# EAGLE design serializer_24x (EAGLE 6.6.0)
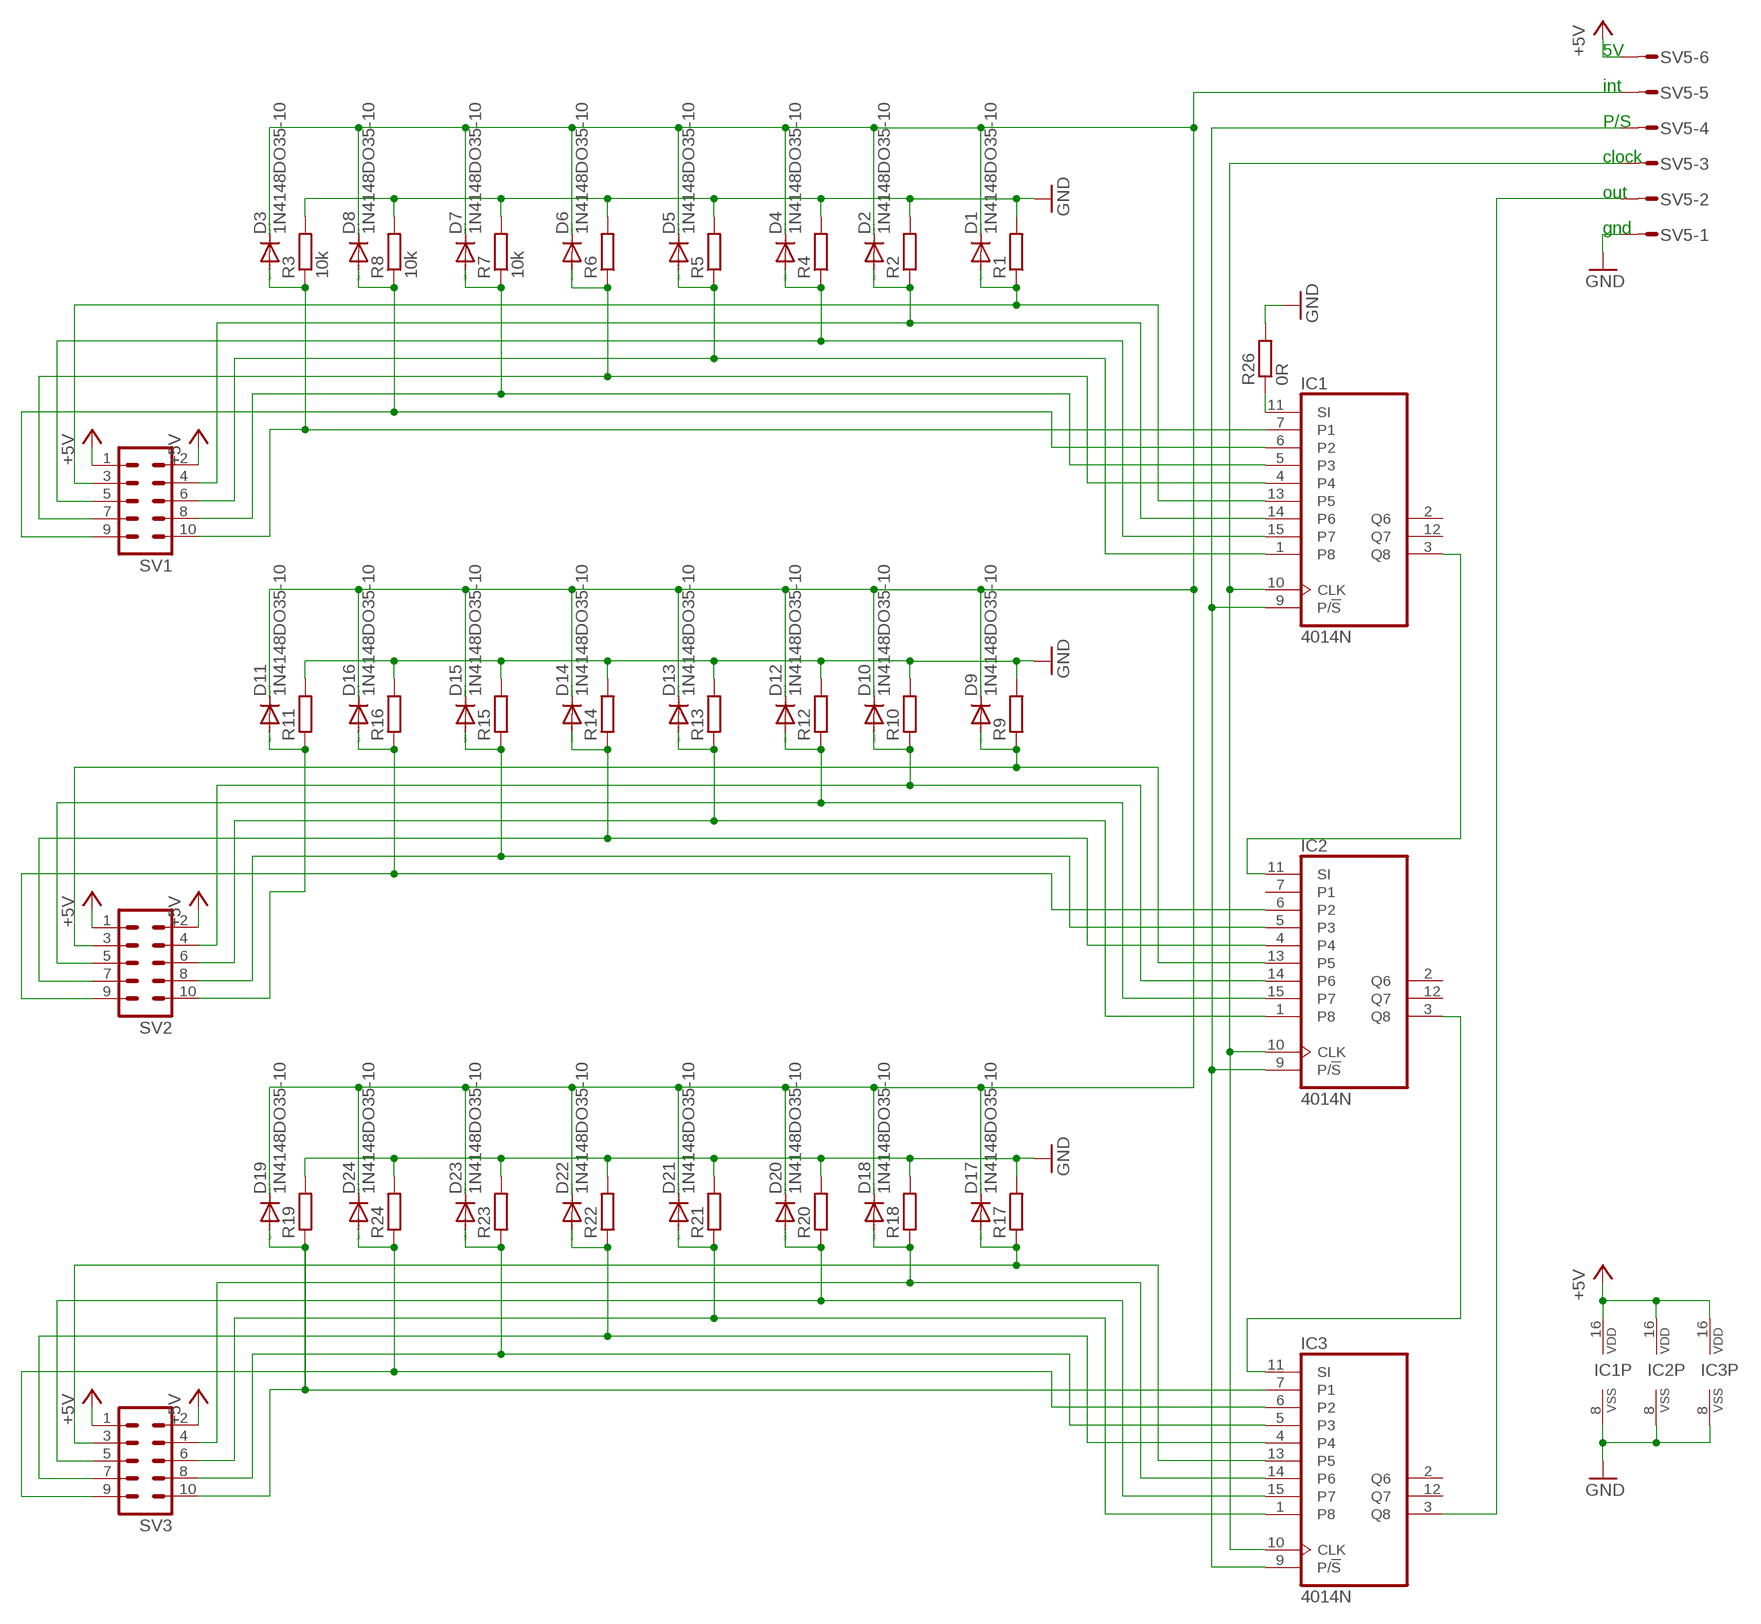
[diagram p0: schematic, sheet 1]

## Parts
D1  1N4148DO35-10  [DO35-10]
D2  1N4148DO35-10  [DO35-10]
D3  1N4148DO35-10  [DO35-10]
D4  1N4148DO35-10  [DO35-10]
D5  1N4148DO35-10  [DO35-10]
D6  1N4148DO35-10  [DO35-10]
D7  1N4148DO35-10  [DO35-10]
D8  1N4148DO35-10  [DO35-10]
D9  1N4148DO35-10  [DO35-10]
D10  1N4148DO35-10  [DO35-10]
D11  1N4148DO35-10  [DO35-10]
D12  1N4148DO35-10  [DO35-10]
D13  1N4148DO35-10  [DO35-10]
D14  1N4148DO35-10  [DO35-10]
D15  1N4148DO35-10  [DO35-10]
D16  1N4148DO35-10  [DO35-10]
D17  1N4148DO35-10  [DO35-10]
D18  1N4148DO35-10  [DO35-10]
D19  1N4148DO35-10  [DO35-10]
D20  1N4148DO35-10  [DO35-10]
D21  1N4148DO35-10  [DO35-10]
D22  1N4148DO35-10  [DO35-10]
D23  1N4148DO35-10  [DO35-10]
D24  1N4148DO35-10  [DO35-10]
IC1  4014N  [DIL16]
IC2  4014N  [DIL16]
IC3  4014N  [DIL16]
R1  R-EU_M1206  [M1206]
R2  R-EU_M1206  [M1206]
R3  10k  R-EU_M1206  [M1206]
R4  R-EU_M1206  [M1206]
R5  R-EU_M1206  [M1206]
R6  R-EU_M1206  [M1206]
R7  10k  R-EU_M1206  [M1206]
R8  10k  R-EU_M1206  [M1206]
R9  R-EU_M1206  [M1206]
R10  R-EU_M1206  [M1206]
R11  R-EU_M1206  [M1206]
R12  R-EU_M1206  [M1206]
R13  R-EU_M1206  [M1206]
R14  R-EU_M1206  [M1206]
R15  R-EU_M1206  [M1206]
R16  R-EU_M1206  [M1206]
R17  R-EU_M1206  [M1206]
R18  R-EU_M1206  [M1206]
R19  R-EU_M1206  [M1206]
R20  R-EU_M1206  [M1206]
R21  R-EU_M1206  [M1206]
R22  R-EU_M1206  [M1206]
R23  R-EU_M1206  [M1206]
R24  R-EU_M1206  [M1206]
R26  0R  R-EU_M1206  [M1206]
SV1  ML10  [ML10]
SV2  ML10  [ML10]
SV3  ML10  [ML10]
SV5  S06P  [S06P]

## Nets
+5V: IC1.16(VDD) IC2.16(VDD) IC3.16(VDD) SV1.1 SV1.2 SV2.1 SV2.2 SV3.1 SV3.2 SV5.6
GND: IC1.8(VSS) IC2.8(VSS) IC3.8(VSS) R1.2 R2.2 R3.2 R4.2 R5.2 R6.2 R7.2 R8.2 R9.2 R10.2 R11.2 R12.2 R13.2 R14.2 R15.2 R16.2 R17.2 R18.2 R19.2 R20.2 R21.2 R22.2 R23.2 R24.2 R26.2 SV5.1
N$1: D1.A IC1.13(P5) R1.1 SV1.3
N$2: D2.A IC1.14(P6) R2.1 SV1.4
N$3: D9.A IC2.13(P5) R9.1 SV2.3
N$4: D10.A IC2.14(P6) R10.1 SV2.4
N$7: D12.A IC2.15(P7) R12.1 SV2.5
N$8: D13.A IC2.1(P8) R13.1 SV2.6
N$9: D14.A IC2.4 R14.1 SV2.7
N$10: D15.A IC2.5(P3) R15.1 SV2.8
N$11: D16.A IC2.6(P2) R16.1 SV2.9
N$12: IC2.3(Q8) IC3.11(SI)
N$13: IC1.10(CLK) IC2.10(CLK) IC3.10(CLK) SV5.3
N$15: D17.A IC3.13(P5) R17.1 SV3.3
N$16: D18.A IC3.14(P6) R18.1 SV3.4
N$17: D1.C D2.C D3.C D4.C D5.C D6.C D7.C D8.C D9.C D10.C D11.C D12.C D13.C D14.C D15.C D16.C D17.C D18.C D19.C D20.C D21.C D22.C D23.C D24.C SV5.5
N$18: D19.A IC3.7(P1) R19.1 SV3.10
N$19: D20.A IC3.15(P7) R20.1 SV3.5
N$20: D21.A IC3.1(P8) R21.1 SV3.6
N$21: D22.A IC3.4 R22.1 SV3.7
N$22: D23.A IC3.5(P3) R23.1 SV3.8
N$23: D24.A IC3.6(P2) R24.1 SV3.9
N$24: IC1.11(SI) R26.1
N$29: D11.A R11.1 SV2.10
N$36: IC3.3(Q8) SV5.2
N$39: D3.A IC1.7(P1) R3.1 SV1.10
N$40: IC1.9(P/!S) IC2.9(P/!S) IC3.9(P/!S) SV5.4
N$41: D4.A IC1.15(P7) R4.1 SV1.5
N$43: D5.A IC1.1(P8) R5.1 SV1.6
N$45: D6.A IC1.4 R6.1 SV1.7
N$47: D7.A IC1.5(P3) R7.1 SV1.8
N$49: D8.A IC1.6(P2) R8.1 SV1.9
N$51: IC1.3(Q8) IC2.11(SI)
Unconnected: IC1.2(Q6) IC1.12(Q7) IC2.2(Q6) IC2.7(P1) IC2.12(Q7) IC3.2(Q6) IC3.12(Q7)

## Notes on the sheet
- 5V
- int
- P/S
- clock
- out
- gnd

## Library data of the parts
D1-D24 = diode:1N4148: DIODE high speed (Philips)
IC1-IC3 = 40xx:4014: 8-bit static SHIFT REGISTER
R1-R24 R26 = resistor:R-EU_: RESISTOR, European symbol
SV1-SV3 = con-ml:ML10: HARTING; OC_FARNELL: unknown; OC_NEWARK: unknown
SV5 = con-amp-mt:S06P: AMP MT CONNECTOR; OC_FARNELL: unknown; OC_NEWARK: unknown

## Board
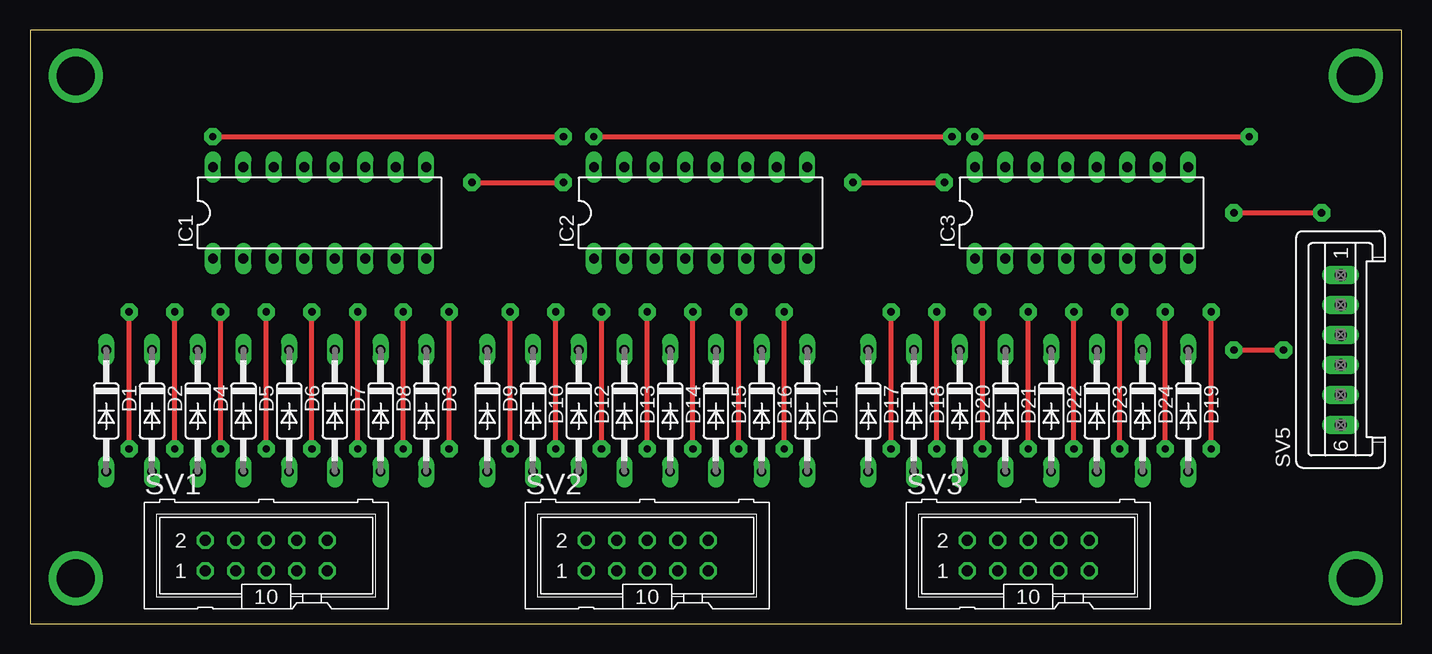
[diagram p1: board, top side]
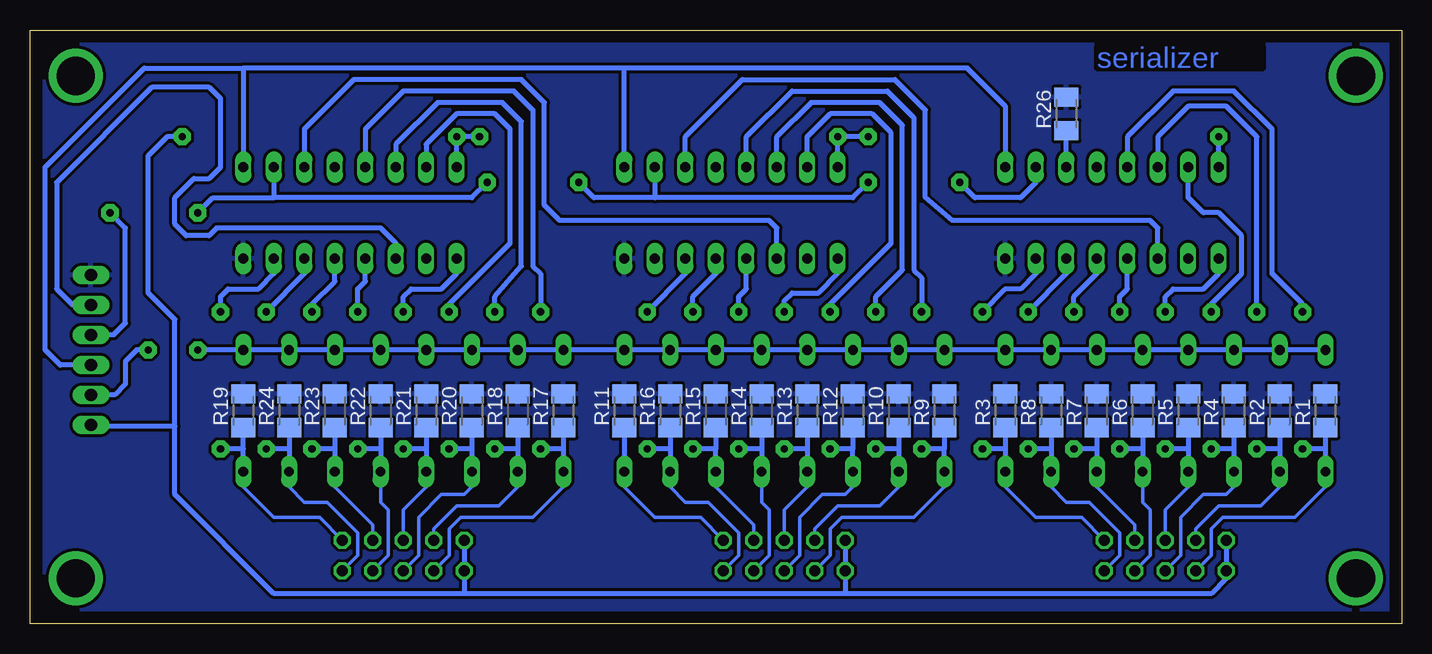
[diagram p2: board, bottom side, seen from below]

Size 114.3 x 49.54 mm. Coordinates in mm from the lower left corner, seen from the top.
Outline: 0,0 114.3,0 114.3,49.53 0,49.54 0,0
Copper layers (1*16): Top 0.035mm / dielectric 1.5mm / Bottom 0.035mm
Design rules "default": minimum track width 10mil, minimum drill 24mil, track to track 8mil, track to pad 8mil, pad to pad 8mil, via to via 8mil, smd to smd 8mil, copper to edge 40mil, drill to drill 8mil, minimum pad ring 10mil, minimum via ring 8mil, stop-mask expansion 4mil, vias tented up to drill 0mil, thermal gap 10mil

### Footprints (pad centres in the part's own frame; a part is rotated, then mirrored left to right if it is on the bottom)
DO35-10 = drill 0.813 long: A 5.08,0; C -5.08,0
DIL16 = drill 0.813 long: 1 -8.89,-3.81; 2 -6.35,-3.81; 3 -3.81,-3.81; 4 -1.27,-3.81; 5 1.27,-3.81; 6 3.81,-3.81; 7 6.35,-3.81; 8 8.89,-3.81; 9 8.89,3.81; 10 6.35,3.81; 11 3.81,3.81; 12 1.27,3.81; 13 -1.27,3.81; 14 -3.81,3.81; 15 -6.35,3.81; 16 -8.89,3.81
M1206 = smd 1.6 x 2: 1 -1.4,0; 2 1.4,0
ML10 = drill 0.914 octagon: 1 -5.08,-1.27; 2 -5.08,1.27; 3 -2.54,-1.27; 4 -2.54,1.27; 5 0,-1.27; 6 0,1.27; 7 2.54,-1.27; 8 2.54,1.27; 9 5.08,-1.27; 10 5.08,1.27
S06P = drill 1.016 long: 1 6.25,0; 2 3.75,0; 3 1.25,0; 4 -1.25,0; 5 -3.75,0; 6 -6.25,0

### Placement (x,y rotation side)
D1  6.35,17.78 270 top
D2  10.16,17.78 270 top
D3  33.02,17.78 270 top
D4  13.97,17.78 270 top
D5  17.78,17.78 270 top
D6  21.59,17.78 270 top
D7  25.4,17.78 270 top
D8  29.21,17.78 270 top
D9  38.1,17.78 270 top
D10  41.91,17.78 270 top
D11  64.77,17.78 270 top
D12  45.72,17.78 270 top
D13  49.53,17.78 270 top
D14  53.34,17.78 270 top
D15  57.15,17.78 270 top
D16  60.96,17.78 270 top
D17  69.85,17.78 270 top
D18  73.66,17.78 270 top
D19  96.52,17.78 270 top
D20  77.47,17.78 270 top
D21  81.28,17.78 270 top
D22  85.09,17.78 270 top
D23  88.9,17.78 270 top
D24  92.71,17.78 270 top
IC1  24.13,34.29 0 top
IC2  55.88,34.29 0 top
IC3  87.63,34.29 0 top
R1  6.35,17.78 90 bottom
R2  10.16,17.78 90 bottom
R3  33.02,17.78 90 bottom
R4  13.97,17.78 90 bottom
R5  17.78,17.78 90 bottom
R6  21.59,17.78 90 bottom
R7  25.4,17.78 90 bottom
R8  29.21,17.78 90 bottom
R9  38.1,17.78 90 bottom
R10  41.91,17.78 90 bottom
R11  64.77,17.78 90 bottom
R12  45.72,17.78 90 bottom
R13  49.53,17.78 90 bottom
R14  53.34,17.78 90 bottom
R15  57.15,17.78 90 bottom
R16  60.96,17.78 90 bottom
R17  69.85,17.78 90 bottom
R18  73.66,17.78 90 bottom
R19  96.52,17.78 90 bottom
R20  77.47,17.78 90 bottom
R21  81.28,17.78 90 bottom
R22  85.09,17.78 90 bottom
R23  88.9,17.78 90 bottom
R24  92.71,17.78 90 bottom
R26  27.94,42.55 90 bottom
SV1  19.68,5.71 0 top
SV2  51.44,5.71 0 top
SV3  83.19,5.71 0 top
SV5  109.22,22.86 90 top

### Tracks (layer width: path | path; a pad name or v marks a point on that pad's centre or on a via)
+5V  (via drill 0.6 pad 1.42)
  Top 0.406: v15.24,40.64 v44.45,40.64 | v46.99,40.64 v76.84,40.64 | v78.74,40.64 v101.6,40.64
  Bottom 0.406: SV5.6 109.12,16.51 102.23,16.51 | IC1.16 v15.24,40.64 | v44.45,40.64 v46.99,40.64 IC2.16 | v76.84,40.64 v78.74,40.64 IC3.16 | v101.6,40.64 102.87,40.64 104.46,39.05 104.46,27.62 102.23,25.4 102.23,16.51 | 102.23,16.51 102.23,10.79 93.98,2.54 78.11,2.54 | SV1.2 SV1.1 14.61,3.81 15.88,2.54 46.36,2.54 | 46.36,2.54 78.11,2.54 | SV3.2 SV3.1 78.11,2.54 | SV2.2 SV2.1 46.36,2.54
GND
  pour Bottom (isolate 0.254): 0,0 114.3,0 114.3,49.53 0,49.53
N$1  (via drill 0.6 pad 1.42)
  Top 0.406: v8.26,14.61 v8.26,26.04
  Bottom 0.305: D1.A 6.35,11.43 8.89,8.89 14.92,8.89 15.88,7.94 15.88,5.71 SV1.3
  Bottom 0.406: 6.35,14.61 D1.A | R1.1 6.35,14.61 | 6.35,14.61 v8.26,14.61 | v8.26,26.04 8.26,26.67 10.79,29.21 10.79,41.28 13.97,44.45 19.05,44.45 22.86,40.64 IC1.13
N$2  (via drill 0.6 pad 1.42)
  Top 0.406: v12.07,14.61 v12.07,26.04
  Bottom 0.305: D2.A 10.16,11.43 11.75,9.84 15.24,9.84 17.14,7.94 SV1.4
  Bottom 0.406: 10.16,14.61 D2.A | R2.1 10.16,14.61 | 10.16,14.61 v12.07,14.61 | v12.07,26.04 12.07,40.64 14.61,43.18 17.78,43.18 20.32,40.64 IC1.14
N$3  (via drill 0.6 pad 1.42)
  Top 0.406: v40.01,14.61 v40.01,26.04
  Bottom 0.305: D9.A 38.1,11.43 40.64,8.89 46.67,8.89 47.62,7.94 47.62,5.71 SV2.3
  Bottom 0.406: D9.A 38.1,14.61 | R9.1 38.1,14.61 | 38.1,14.61 v40.01,14.61 | IC2.13 54.61,40.64 50.8,44.45 42.86,44.45 40.64,42.23 40.64,29.53 40.01,28.89 v40.01,26.04
N$4  (via drill 0.6 pad 1.42)
  Top 0.406: v43.82,14.61 v43.82,26.04
  Bottom 0.305: D10.A 41.91,11.43 43.5,9.84 46.99,9.84 48.9,7.94 SV2.4
  Bottom 0.406: 41.91,14.61 D10.A | R10.1 41.91,14.61 | 41.91,14.61 v43.82,14.61 | v43.82,26.04 43.82,27.3 41.59,29.53 41.59,41.59 43.5,43.5 49.21,43.5 52.07,40.64 IC2.14
N$5  (via drill 3.2 pad 4.5)
  other vias: 3.81,3.81
N$7  (via drill 0.6 pad 1.42)
  Top 0.406: v47.62,14.61 v47.62,26.04
  Bottom 0.305: D12.A 45.72,11.43 46.36,10.79 48.26,10.79 50.16,8.89 50.16,5.71 SV2.5
  Bottom 0.406: D12.A 45.72,14.61 | R12.1 45.72,14.61 | 45.72,14.61 v47.62,14.61 | v47.62,26.04 47.62,26.67 42.55,31.75 42.55,40.96 44.13,42.55 47.62,42.55 49.53,40.64 IC2.15
N$8  (via drill 0.6 pad 1.42)
  Top 0.406: v51.44,14.61 v51.44,26.04
  Bottom 0.305: SV2.6 51.44,9.53 49.53,11.43 D13.A
  Bottom 0.406: 49.53,14.61 D13.A | R13.1 49.53,14.61 | 49.53,14.61 v51.44,14.61 | v51.44,26.04 51.44,26.99 50.8,27.62 48.58,27.62 46.99,29.21 IC2.1
N$9  (via drill 0.6 pad 1.42)
  Top 0.406: v55.25,14.61 v55.25,26.04
  Bottom 0.305: SV2.7 52.71,5.71 52.71,9.53 53.34,10.16 D14.A
  Bottom 0.406: 53.34,14.61 D14.A | R14.1 53.34,14.61 | 53.34,14.61 v55.25,14.61 | v55.25,26.04 55.25,27.3 54.61,27.94 IC2.4
N$10  (via drill 0.6 pad 1.42)
  Top 0.406: v59.05,14.61 v59.05,26.04
  Bottom 0.305: SV2.8 53.98,8.26 57.15,11.43 D15.A
  Bottom 0.406: D15.A 57.15,14.61 | R15.1 57.15,14.61 | 57.15,14.61 v59.05,14.61 | v59.05,26.04 59.05,27.3 57.15,29.21 IC2.5
N$11  (via drill 0.6 pad 1.42)
  Top 0.406: v62.87,14.61 v62.87,26.04
  Bottom 0.305: SV2.9 55.25,5.71 55.25,7.62 57.79,10.16 59.69,10.16 60.96,11.43 D16.A
  Bottom 0.406: 60.96,14.61 D16.A | R16.1 60.96,14.61 | 60.96,14.61 v62.87,14.61 | v62.87,26.04 59.69,29.21 IC2.6
N$12
  Bottom 0.406: IC2.3 52.07,33.02 52.71,33.66 70.17,33.66 71.44,34.92 71.44,43.5 73.34,45.4 87.31,45.4 91.44,41.28 IC3.11
N$13  (via drill 0.6 pad 1.42)
  Top 0.406: v36.83,36.83 v44.45,36.83 | v68.58,36.83 v76.2,36.83 | v100.33,34.29 v107.63,34.29
  Bottom 0.406: IC1.10 30.48,36.83 31.75,35.56 35.56,35.56 v36.83,36.83 | v44.45,36.83 45.72,35.56 62.23,35.56 | IC2.10 62.23,35.56 | v76.2,36.83 77.47,35.56 93.98,35.56 | IC3.10 93.98,35.56 | SV5.3 109.2,24.13 107.31,24.13 106.36,25.08 106.36,33.02 v107.63,34.29 | 62.23,35.56 67.31,35.56 v68.58,36.83 | v100.33,34.29 99.06,35.56 93.98,35.56
N$14  (via drill 3.2 pad 4.5)
  other vias: 3.81,45.72
N$15  (via drill 0.6 pad 1.42)
  Top 0.406: v71.75,14.61 v71.75,26.04
  Bottom 0.305: D17.A 69.85,11.43 72.39,8.89 78.42,8.89 79.38,7.94 79.38,5.71 SV3.3
  Bottom 0.406: 69.85,14.61 D17.A | R17.1 69.85,14.61 | 69.85,14.61 v71.75,14.61 | IC3.13 86.36,41.28 83.19,44.45 73.98,44.45 72.39,42.86 72.39,29.84 71.75,29.21 v71.75,26.04
N$16  (via drill 0.6 pad 1.42)
  Top 0.406: v75.56,14.61 v75.56,26.04
  Bottom 0.305: D18.A 73.66,11.43 75.25,9.84 78.74,9.84 80.64,7.94 SV3.4
  Bottom 0.406: 73.66,14.61 D18.A | R18.1 73.66,14.61 | 73.66,14.61 v75.56,14.61 | v75.56,26.04 75.56,27.3 73.34,29.84 73.34,41.91 74.93,43.5 80.33,43.5 83.82,40.01 IC3.14
N$17  (via drill 0.6 pad 1.42)
  Top 0.406: v100.33,22.86 v104.46,22.86
  Bottom 0.406: D1.C D2.C D4.C D5.C D6.C D7.C D8.C D3.C D9.C D10.C D12.C D13.C D14.C D15.C D16.C D11.C D17.C D18.C D20.C D21.C D22.C D23.C D24.C D19.C v100.33,22.86 | v104.46,22.86 105.41,22.86 106.36,21.91 106.36,20 107.25,19.11 SV5.5
N$18  (via drill 0.6 pad 1.42)
  Top 0.406: v98.42,14.61 v98.42,26.04
  Bottom 0.305: SV3.10 90.17,8.89 93.98,8.89 96.52,11.43 D19.A
  Bottom 0.406: D19.A 96.52,14.61 | 96.52,14.61 R19.1 96.52,16.51 | IC3.7 93.98,29.21 95.25,27.94 97.79,27.94 98.42,27.3 v98.42,26.04 | 96.52,14.61 v98.42,14.61
N$19  (via drill 0.6 pad 1.42)
  Top 0.406: v79.38,14.61 v79.38,26.04
  Bottom 0.305: D20.A 77.47,11.43 78.11,10.79 80.01,10.79 81.92,8.89 81.92,5.71 SV3.5
  Bottom 0.406: 77.47,14.61 D20.A | R20.1 77.47,14.61 | 77.47,14.61 v79.38,14.61 | v79.38,26.04 79.38,26.67 74.3,31.75 74.3,41.28 75.56,42.55 78.74,42.55 81.28,40.01 IC3.15
N$20  (via drill 0.6 pad 1.42)
  Top 0.406: v83.19,14.61 v83.19,26.04
  Bottom 0.305: SV3.6 83.19,9.53 81.28,11.43 D21.A
  Bottom 0.406: 81.28,14.61 D21.A | R21.1 81.28,14.61 | 81.28,14.61 v83.19,14.61 | v83.19,26.04 83.19,27.3 82.55,27.94 80.01,27.94 78.74,29.21 IC3.1
N$21  (via drill 0.6 pad 1.42)
  Top 0.406: v87,14.61 v87,26.04
  Bottom 0.305: SV3.7 84.45,5.71 84.45,9.53 85.09,10.16 D22.A
  Bottom 0.406: 85.09,14.61 D22.A | R22.1 85.09,14.61 | 85.09,14.61 v87,14.61 | v87,26.04 87,27.94 86.36,28.57 IC3.4
N$22  (via drill 0.6 pad 1.42)
  Top 0.406: v90.81,14.61 v90.81,26.04
  Bottom 0.305: SV3.8 85.73,8.26 88.9,11.43 D23.A
  Bottom 0.406: 88.9,14.61 D23.A | R23.1 88.9,14.61 | 88.9,14.61 v90.81,14.61 | v90.81,26.04 90.81,26.67 88.9,28.57 IC3.5
N$23  (via drill 0.6 pad 1.42)
  Top 0.406: v94.62,14.61 v94.62,26.04
  Bottom 0.305: SV3.9 87,5.71 87,7.62 89.53,10.16 91.44,10.16 92.71,11.43 D24.A
  Bottom 0.406: 92.71,14.61 D24.A | R24.1 92.71,14.61 | 92.71,14.61 v94.62,14.61 | v94.62,26.04 91.44,29.21 IC3.6
N$24
  Bottom 0.406: IC1.11 R26.1
N$25  (via drill 3.2 pad 4.5)
  other vias: 110.49,45.72
N$26  (via drill 3.2 pad 4.5)
  other vias: 110.49,3.81
N$29
  Bottom 0.305: SV2.10 58.42,8.89 62.23,8.89 64.77,11.43 D11.A
  Bottom 0.406: R11.1 D11.A
N$36
  Bottom 0.406: SV5.2 110.75,26.61 112.08,27.94 112.08,36.83 104.14,44.77 99.38,44.77 98.42,43.82 98.42,38.1 99.38,37.15 100.65,37.15 102.23,35.56 102.23,33.34 101.28,32.38 99.38,32.38 98.74,33.02 85.09,33.02 83.82,31.75 IC3.3
N$39  (via drill 0.6 pad 1.42)
  Top 0.406: v34.92,14.61 v34.92,26.04
  Bottom 0.305: SV1.10 26.67,8.89 30.48,8.89 33.02,11.43 D3.A
  Bottom 0.406: 33.02,14.61 D3.A | IC1.7 30.48,29.21 31.75,27.94 33.02,27.94 v34.92,26.04 | R3.1 33.02,14.61 | 33.02,14.61 v34.92,14.61
N$40
  Bottom 0.406: 96.52,46.36 IC3.9 | IC1.9 33.02,43.18 36.2,46.36 64.77,46.36 | SV5.4 111.78,21.59 111.76,21.59 113.03,22.86 113.03,38.1 104.78,46.36 96.52,46.36 | IC2.9 64.77,46.36 | 64.77,46.36 96.52,46.36
N$41  (via drill 0.6 pad 1.42)
  Top 0.406: v15.88,14.61 v15.88,26.04
  Bottom 0.305: D4.A 13.97,11.43 14.61,10.79 16.51,10.79 18.41,8.89 18.41,5.71 SV1.5
  Bottom 0.406: 13.97,14.61 D4.A | R4.1 13.97,14.61 | 13.97,14.61 v15.88,14.61 | v15.88,26.04 15.88,26.67 13.34,29.21 13.34,32.38 15.24,34.29 16.51,34.29 17.78,35.56 IC1.15
N$43  (via drill 0.6 pad 1.42)
  Top 0.406: v19.68,14.61 v19.68,26.04
  Bottom 0.305: SV1.6 19.68,9.53 17.78,11.43 D5.A
  Bottom 0.406: 17.78,14.61 D5.A | R5.1 17.78,14.61 | 17.78,14.61 v19.68,14.61 | v19.68,26.04 19.68,27.3 19.05,27.94 16.51,27.94 15.24,29.21 IC1.1
N$45  (via drill 0.6 pad 1.42)
  Top 0.406: v23.49,14.61 v23.49,26.04
  Bottom 0.305: SV1.7 20.95,5.71 20.95,9.53 21.59,10.16 D6.A
  Bottom 0.406: 21.59,14.61 D6.A | R6.1 21.59,14.61 | 21.59,14.61 v23.49,14.61 | v23.49,26.04 23.49,27.3 22.86,27.94 IC1.4
N$47  (via drill 0.6 pad 1.42)
  Top 0.406: v27.3,14.61 v27.3,26.04
  Bottom 0.305: SV1.8 22.22,8.26 25.4,11.43 D7.A
  Bottom 0.406: 25.4,14.61 D7.A | R7.1 25.4,14.61 | 25.4,14.61 v27.3,14.61 | v27.3,26.04 27.3,27.3 25.4,29.21 IC1.5
N$49  (via drill 0.6 pad 1.42)
  Top 0.406: v31.11,14.61 v31.11,26.04
  Bottom 0.305: SV1.9 23.49,5.71 23.49,7.62 26.04,10.16 27.94,10.16 29.21,11.43 D8.A
  Bottom 0.406: 29.21,14.61 D8.A | R8.1 29.21,14.61 | 29.21,14.61 v31.11,14.61 | v31.11,26.04 27.94,29.21 IC1.6
N$51
  Bottom 0.406: IC1.3 20.32,33.02 20.95,33.66 37.47,33.66 39.69,35.56 39.69,42.86 42.23,45.4 54.93,45.4 59.69,40.64 IC2.11

### Text on the board
Bottom: serializer